# Altium schematic sheet MCU.SchDoc: AC POWER METER
size 420 x 297 mm; DrawnBy: Truong Giang; DocumentNumber: Learning; SheetNumber: 4; SheetTotal: 6
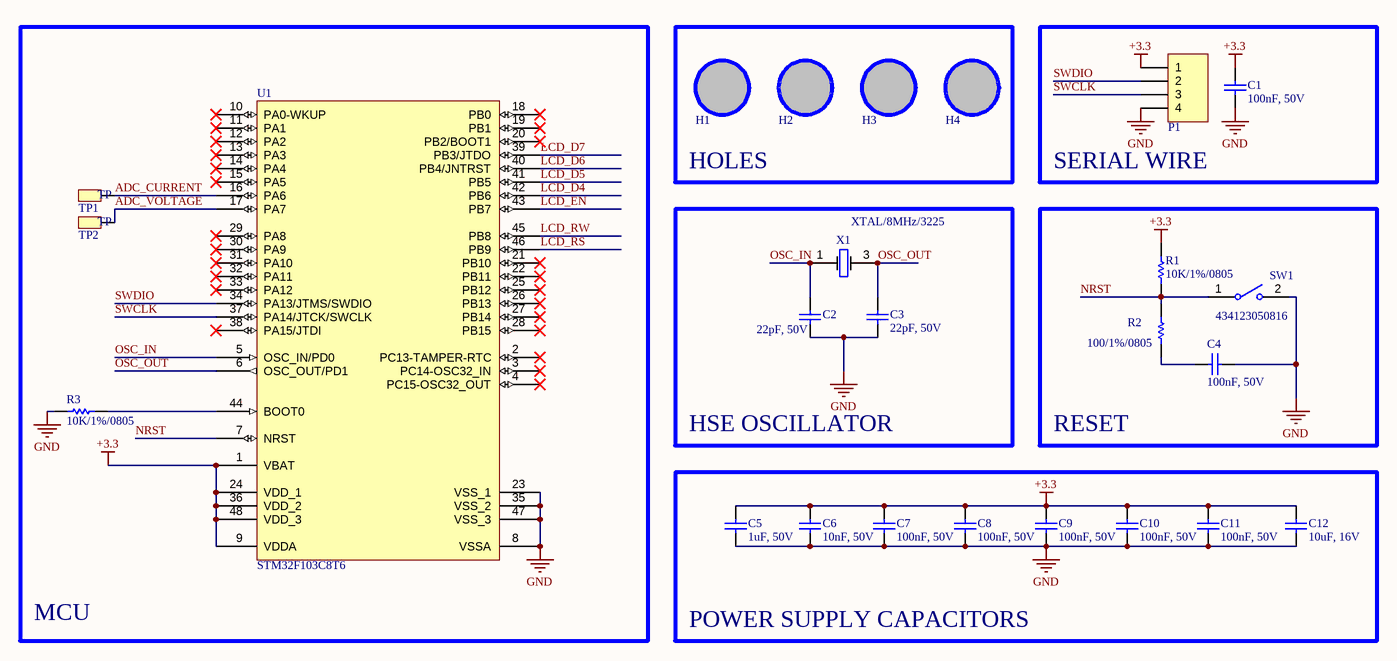
[diagram p0: MCU.SchDoc]

## Parts
C1  100nF, 50V  [WCAP-CSGP_0805_H=0.8mm_Wave]
C2  22pF, 50V  [WCAP-CSGP_0805_H=0.6mm_Reflow]
C3  22pF, 50V  [WCAP-CSGP_0805_H=0.6mm_Reflow]
C4  100nF, 50V  [WCAP-CSGP_0805_H=0.8mm_Wave]
C5  1uF, 50V  [WCAP-CSGP_0805_H=1.25mm]
C6  10nF, 50V  [WCAP-CSGP_0805_H=0.8mm_Reflow]
C7  100nF, 50V  [WCAP-CSGP_0805_H=0.8mm_Wave]
C8  100nF, 50V  [WCAP-CSGP_0805_H=0.8mm_Wave]
C9  100nF, 50V  [WCAP-CSGP_0805_H=0.8mm_Wave]
C10  100nF, 50V  [WCAP-CSGP_0805_H=0.8mm_Wave]
C11  100nF, 50V  [WCAP-CSGP_0805_H=0.8mm_Wave]
C12  10uF, 16V  [WCAP-CSGP_0805_H=1.25mm]
H1  Hole  [LO KHOAN 3MM]  (value not drawn)
H2  Hole  [LO KHOAN 3MM]  (value not drawn)
H3  Hole  [LO KHOAN 3MM]  (value not drawn)
H4  Hole  [LO KHOAN 3MM]  (value not drawn)
P1  Header 4  [JP4]  (value not drawn)
R1  value 10K/1%/0805  [RES-SM-0805]  (hidden comment: RESISTOR SMD)
R2  value 100/1%/0805  [RES-SM-0805]  (hidden comment: RESISTOR SMD)
R3  value 10K/1%/0805  [RES-SM-0805]  (hidden comment: RESISTOR SMD)
SW1  434123050816  [WS-TASV_L6W3.5H5_4341x30508x6]
TP1  Test Point  [TP]  (value not drawn)
TP2  Test Point  [TP]  (value not drawn)
U1  STM32F103C8T6  [TSQFP50P900X900X160-48N]
X1  XTAL/8MHz/3225  [XTAL 3225]

## Blocks framed on the sheet
MCU: R3 TP1 TP2 U1
HOLES: H1-H4
SERIAL WIRE: C1 P1
HSE OSCILLATOR: C2 C3 X1
RESET: C4 R1 R2 SW1
POWER SUPPLY CAPACITORS: C5-C12

## Nets
+3.3: C1.1 C5.2 C6.2 C7.2 C8.2 C9.2 C10.2 C11.2 C12.2 P1.1 R1.2 U1.1(VBAT) U1.9(VDDA) U1.24(VDD_1) U1.36(VDD_2) U1.48(VDD_3)
GND: C1.2 C2.1 C3.1 C4.1 C5.1 C6.1 C7.1 C8.1 C9.1 C10.1 C11.1 C12.1 P1.4 R3.2 SW1.2 U1.8(VSSA) U1.23(VSS_1) U1.35(VSS_2) U1.47(VSS_3)
ADC_CURRENT: TP1.TP1 U1.16(PA6)
ADC_VOLTAGE: TP2.TP1 U1.17(PA7)
LCD_D4: U1.42(PB6)
LCD_D5: U1.41(PB5)
LCD_D6: U1.40(PB4/JNTRST)
LCD_D7: U1.39(PB3/JTDO)
LCD_EN: U1.43(PB7)
LCD_RS: U1.46(PB9)
LCD_RW: U1.45(PB8)
NRST: R1.1 R2.2 SW1.1 U1.7(NRST)
OSC_IN: C2.2 U1.5(OSC_IN/PD0) X1.1
OSC_OUT: C3.2 U1.6(OSC_OUT/PD1) X1.3
SWCLK: P1.3 U1.37(PA14/JTCK/SWCLK)
SWDIO: P1.2 U1.34(PA13/JTMS/SWDIO)
NetC4_2: C4.2 R2.1
NetR3_1: R3.1 U1.44(BOOT0)

Not connected (* = marked no-connect by the designer): H1 1; H2 1; H3 1; H4 1; U1 2(PC13-TAMPER-RTC)* 3(PC14-OSC32_IN)* 4(PC15-OSC32_OUT)* 10(PA0-WKUP)* 11(PA1)* 12(PA2)* 13(PA3)* 14(PA4)* 15(PA5)* 18(PB0)* 19(PB1)* 20(PB2/BOOT1)* 21(PB10)* 22(PB11)* 25(PB12)* 26(PB13)* 27(PB14)* 28(PB15)* 29(PA8)* 30(PA9)* 31(PA10)* 32(PA11)* 33(PA12)* 38(PA15/JTDI)*

## Notes on the sheet
- PROJECT
- TITLE
- DRAWN BY
- SIZE
- FILE NAME
- SHEET
- OF
- A3
- (in symbol Test Point) TP

## Library data of the parts
C1 C4 C7-C11 = 885012207098: WCAP-CSGP Multilayer Ceramic Chip Capacitor, General Purpose, size 0805, X7R, 100nF, 50V; Manufacturer: Wurth Elektronik; Rated Voltage: 50VDC; Isolation Resistance: >=5GOhm; Capacitance Tolerance: +/-10%; Technical Reference: X7R0805104K050DFCT10000; ComponentLink1Description: Manufacturer; ComponentLink1URL: http://www.we-online.de; ComponentLink2Description: Datasheet; ComponentLink2URL: https://www.we-online.com/catalog/datasheet/885012207098.pdf; Operating Temperature: -55 to +125degC; Packaging: Tape and Reel; Manufacturer Part Number: 885012207098; Published Date: May 2020; Ceramic Type: X7R; Dissipation Factor: =<2.5%; Height: 0.8mm; Mounting Technology: SMT; Size: 0805; Capacitance: 100nF
C2 C3 = 885012007053: WCAP-CSGP Multilayer Ceramic Chip Capacitor, General Purpose, size 0805, NP0, 22pF, 50V; Manufacturer: Wurth Elektronik; Rated Voltage: 50VDC; Isolation Resistance: >=10GOhm; Capacitance Tolerance: +/-5%; Dissipation Factor: Q>=400+20C; Technical Reference: NP00805220J050DFCT10000; ComponentLink1Description: Manufacturer; ComponentLink1URL: http://www.we-online.de; ComponentLink2Description: Datasheet; ComponentLink2URL: https://www.we-online.com/catalog/datasheet/885012007053.pdf; Operating Temperature: -55 to +125degC; Packaging: Tape and Reel; Manufacturer Part Number: 885012007053; Published Date: May 2020; Ceramic Type: NP0; Height: 0.6mm; Mounting Technology: SMT; Size: 0805; Capacitance: 22pF
C5 = 885012207103: WCAP-CSGP Multilayer Ceramic Chip Capacitor, General Purpose, size 0805, X7R, 1uF, 50V; Manufacturer: Wurth Elektronik; Rated Voltage: 50VDC; Isolation Resistance: >=0.1GOhm; Capacitance Tolerance: +/-10%; Technical Reference: X7R0805105K050DFCT10000; ComponentLink1Description: Manufacturer; ComponentLink1URL: http://www.we-online.de; ComponentLink2Description: Datasheet; ComponentLink2URL: https://www.we-online.com/catalog/datasheet/885012207103.pdf; Operating Temperature: -55 to +125degC; Packaging: Tape and Reel; Manufacturer Part Number: 885012207103; Published Date: May 2020; Ceramic Type: X7R; Dissipation Factor: =<10%; Height: 1.25mm; Mounting Technology: SMT; Size: 0805; Capacitance: 1uF
C6 = 885012207092: WCAP-CSGP Multilayer Ceramic Chip Capacitor, General Purpose, size 0805, X7R, 10nF, 50V; Manufacturer: Wurth Elektronik; Rated Voltage: 50VDC; Isolation Resistance: >=10GOhm; Capacitance Tolerance: +/-10%; Technical Reference: X7R0805103K050DFCT10000; ComponentLink1Description: Manufacturer; ComponentLink1URL: http://www.we-online.de; ComponentLink2Description: Datasheet; ComponentLink2URL: https://www.we-online.com/catalog/datasheet/885012207092.pdf; Operating Temperature: -55 to +125degC; Packaging: Tape and Reel; Manufacturer Part Number: 885012207092; Published Date: May 2020; Ceramic Type: X7R; Dissipation Factor: =<2.5%; Height: 0.8mm; Mounting Technology: SMT; Size: 0805; Capacitance: 10nF
C12 = 885012107014: WCAP-CSGP Multilayer Ceramic Chip Capacitor, General Purpose, size 0805, X5R, 10uF, 16V; Manufacturer: Wurth Elektronik; Rated Voltage: 16VDC; Isolation Resistance: >=0.005GOhm; Capacitance Tolerance: +/-20%; Technical Reference: X5R0805106M016DFCT10000; ComponentLink1Description: Manufacturer; ComponentLink1URL: http://www.we-online.de; ComponentLink2Description: Datasheet; ComponentLink2URL: https://www.we-online.com/catalog/datasheet/885012107014.pdf; Operating Temperature: -55 to +85degC; Packaging: Tape and Reel; Manufacturer Part Number: 885012107014; Published Date: May 2020; Ceramic Type: X5R; Dissipation Factor: =<10%; Height: 1.25mm; Mounting Technology: SMT; Size: 0805; Capacitance: 10uF
H1-H4 = Hole: Hole 3mm
P1 = Header 4: Header, 4-Pin; LatestRevisionDate: 17-Jul-2002; LatestRevisionNote: Re-released for DXP Platform.; Publisher: Altium Limited
R1-R3 = RESISTOR SMD: Resistor
SW1 = 434123050816: WS-TASV J-Bend SMT Tact Switch, 12VDC, 50mA, 160g, height 5mm; Manufacturer: Wurth Elektronik; Rated Voltage: 12V; Washable: No; Actuator Color: Black; Electrical Life: 50000Cycles; ComponentLink1Description: Manufacturer Link; ComponentLink1URL: http://www.we-online.de; ComponentLink2Description: Datasheet; ComponentLink2URL: https://www.we-online.com/catalog/datasheet/434123050816.pdf; Manufacturer Part Number: 434123050816; Contact Material: Stainless Steel; Mounting Technology: SMT; Contact Plating: Silver; Operation Force: 160g; Packaging: Tape and Reel; Terminal Material: Copper Alloy; Rated Current: 50mA; Terminal Plating: Silver; Height: 5mm; Length: 6mm; Operating Temperature max.: 85C; Operating Temperature min.: -40C; Width: 3.5mm
U1 = STM32F103C8T6: Manufacturer: ST; ComponentLink1Description: Supplier 1 Link
X1 = XTAL: Value: 16MHz